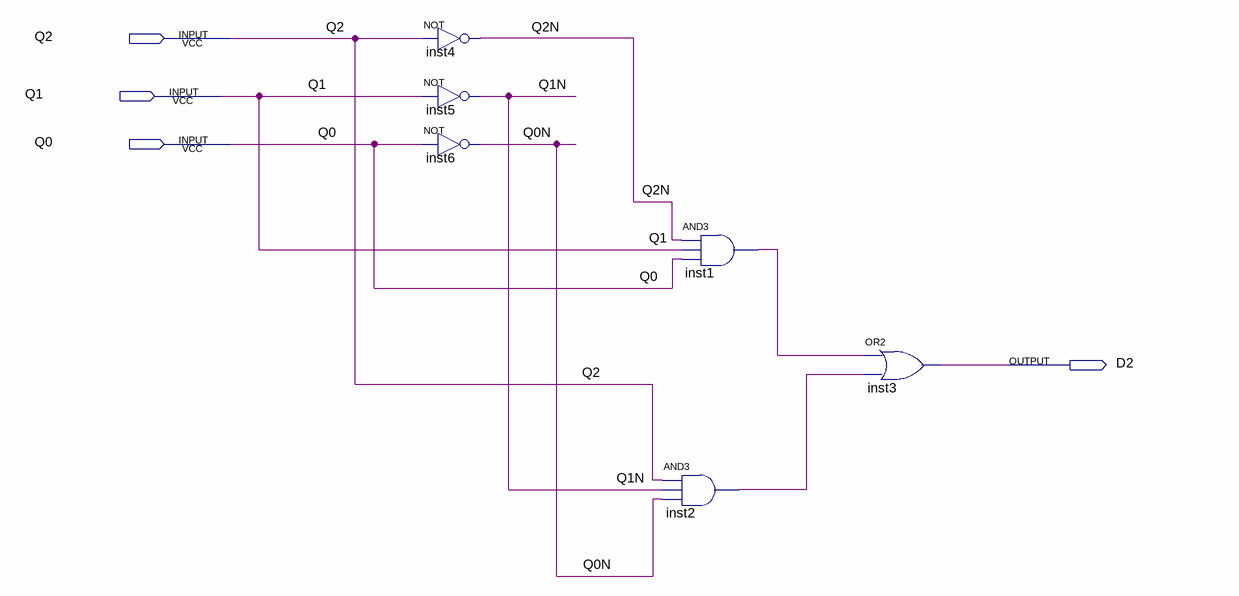
[diagram p0: schematic sheet]
// Quartus schematic D2.bdf as structural Verilog: 6 symbols, 4 pins
module D2 (
  input  Q2,
  input  Q1,
  input  Q0,
  output D2
);

  wire inst1_out, inst2_out, Q0N, Q1N, Q2N;

  not inst4 (Q2N, Q2);
  not inst5 (Q1N, Q1);
  not inst6 (Q0N, Q0);
  and inst1 (inst1_out, Q2N, Q1, Q0);
  and inst2 (inst2_out, Q2, Q1N, Q0N);
  or inst3 (D2, inst1_out, inst2_out);
endmodule
